# EAGLE design MS5611 Modular (EAGLE 8.0.0)
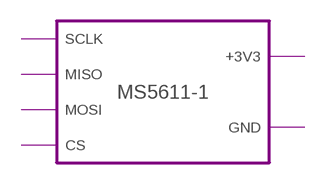
[diagram p0: schematic, sheet 1]

## Module instances
MS5611-1 = MS5611

## Library data of the parts

## Module MS5611
Ports: SCLK(in) MISO(out) MOSI(in) CS(in) +3V3(pwr) GND(pwr)
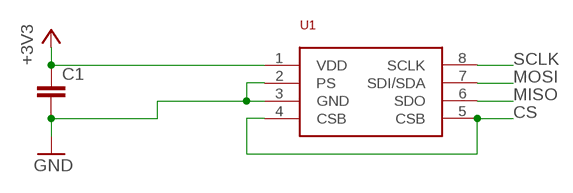
[diagram p1: schematic, module MS5611, sheet 1]

### Parts
C1  C-EUC0603  [C0603]
U1  MS5611  [MS5611]

### Nets
+3V3: C1.1 U1.1(VDD)
CS: U1.4(CSB) U1.5(CSB)
GND: C1.2 U1.2(PS) U1.3(GND)
MISO: U1.6(SDO)
MOSI: U1.7(SDI/SDA)
SCLK: U1.8(SCLK)

### Library data of the parts
C1 = rcl:C-EU: CAPACITOR, European symbol
U1 = Measurement Specialties:MS5611: MS5611 Pressure Sensor from SEAS Switzerland.

## Board
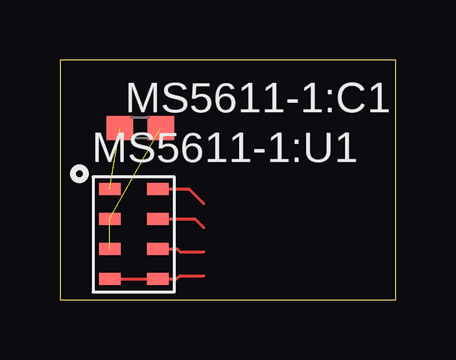
[diagram p2: board, top side]

Size 14 x 10 mm. Coordinates in mm from the lower left corner, seen from the top.
Outline: 0,0 14,0 14,10 0,10 0,0
Copper layers (1*16): Top 0.035mm / dielectric 1.5mm / Bottom 0.035mm
Design rules "default": minimum track width 10mil, minimum drill 24mil, track to track 8mil, track to pad 8mil, pad to pad 8mil, via to via 8mil, smd to smd 8mil, copper to edge 40mil, drill to drill 8mil, minimum pad ring 10mil, minimum via ring 8mil, stop-mask expansion 4mil, vias tented up to drill 0mil, thermal gap 10mil

### Footprints (pad centres in the part's own frame; a part is rotated, then mirrored left to right if it is on the bottom)
C0603 = smd 1.1 x 1: 1 -0.85,0; 2 0.85,0
MS5611 = smd 0.9 x 0.5: 1 0,0; 2 0,-1.25; 3 0,-2.5; 4 0,-3.75; 5 2,-3.75; 6 2,-2.5; 7 2,-1.25; 8 2,0

### Placement (x,y rotation side)
MS5611-1:C1  [C0603]  3.35,7.16 0 top
MS5611-1:U1  [MS5611]  2.08,4.62 0 top

### Tracks (layer width: path | path; a pad name or v marks a point on that pad's centre or on a via)
MS5611-1:+3V3  (1 unrouted)
MS5611-1:CS
  Top 0.13: MS5611-1:U1.4 MS5611-1:U1.5 4.87,0.87 5,1 6,1
MS5611-1:GND  (2 unrouted)
MS5611-1:MISO
  Top 0.13: MS5611-1:U1.6 4.88,2.12 5,2 6,2
MS5611-1:MOSI
  Top 0.13: MS5611-1:U1.7 5.63,3.37 6,3
MS5611-1:SCLK
  Top 0.13: MS5611-1:U1.8 5.38,4.62 6,4